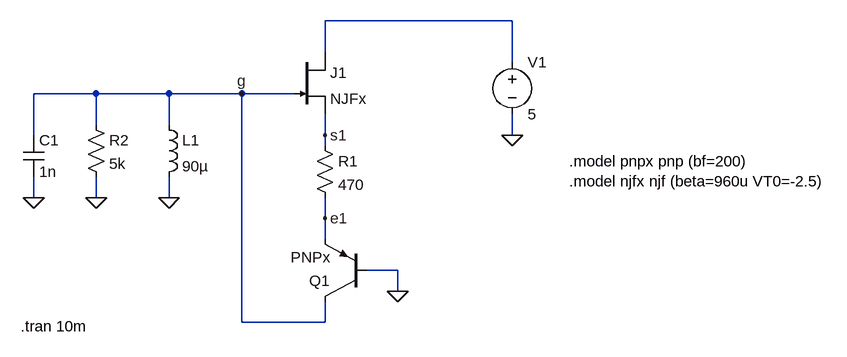
[diagram p0: schematic ss2010_oszill.asc]
ss2010_oszill.asc, the LTspice schematic file:
Version 4
SHEET 1 1004 1076
WIRE 448 -64 160 -64
WIRE 160 -16 160 -64
WIRE 448 0 448 -64
WIRE -192 48 -288 48
WIRE -80 48 -192 48
WIRE 32 48 -80 48
WIRE 112 48 32 48
WIRE -192 96 -192 48
WIRE -80 96 -80 48
WIRE -288 112 -288 48
WIRE 160 112 160 80
WIRE 448 112 448 80
WIRE 160 128 160 112
WIRE -288 208 -288 176
WIRE -192 208 -192 176
WIRE -80 208 -80 176
WIRE 160 240 160 208
WIRE 160 272 160 240
WIRE 272 320 224 320
WIRE 272 352 272 320
WIRE 32 400 32 48
WIRE 160 400 160 368
WIRE 160 400 32 400
FLAG -288 208 0
FLAG -192 208 0
FLAG -80 208 0
FLAG 448 112 0
FLAG 272 352 0
FLAG 160 112 s1
FLAG 160 240 e1
FLAG 32 48 g
SYMBOL njf 112 -16 R0
SYMATTR InstName J1
SYMATTR Value NJFx
SYMBOL res 144 112 R0
SYMATTR InstName R1
SYMATTR Value 470
SYMBOL pnp 224 368 R180
SYMATTR InstName Q1
SYMATTR Value PNPx
SYMBOL voltage 448 -16 R0
WINDOW 123 0 0 Left 2
WINDOW 39 0 0 Left 2
SYMATTR InstName V1
SYMATTR Value 5
SYMBOL res -208 80 R0
SYMATTR InstName R2
SYMATTR Value 5k
SYMBOL ind -96 80 R0
SYMATTR InstName L1
SYMATTR Value 90µ
SYMBOL cap -304 112 R0
SYMATTR InstName C1
SYMATTR Value 1n
TEXT 536 152 Left 2 !.model pnpx pnp (bf=200)\n.model njfx njf (beta=960u VT0=-2.5)
TEXT -308 406 Left 2 !.tran 10m

The netlist it stands for:
* ss2010_oszill.asc
J1 N001 g s1 NJFx
R1 s1 e1 470
Q1 g 0 e1 0 PNPx
V1 N001 0 5
R2 g 0 5k
L1 g 0 90µ
C1 g 0 1n
.model NPN NPN
.model PNP PNP
.lib standard.bjt
.model NJF NJF
.model PJF PJF
.lib standard.jft
.model pnpx pnp (bf=200)
.model njfx njf (beta=960u VT0=-2.5)
.tran 10m
.backanno
.end